# EAGLE design 20x20_adapter (EAGLE 9.4.2)
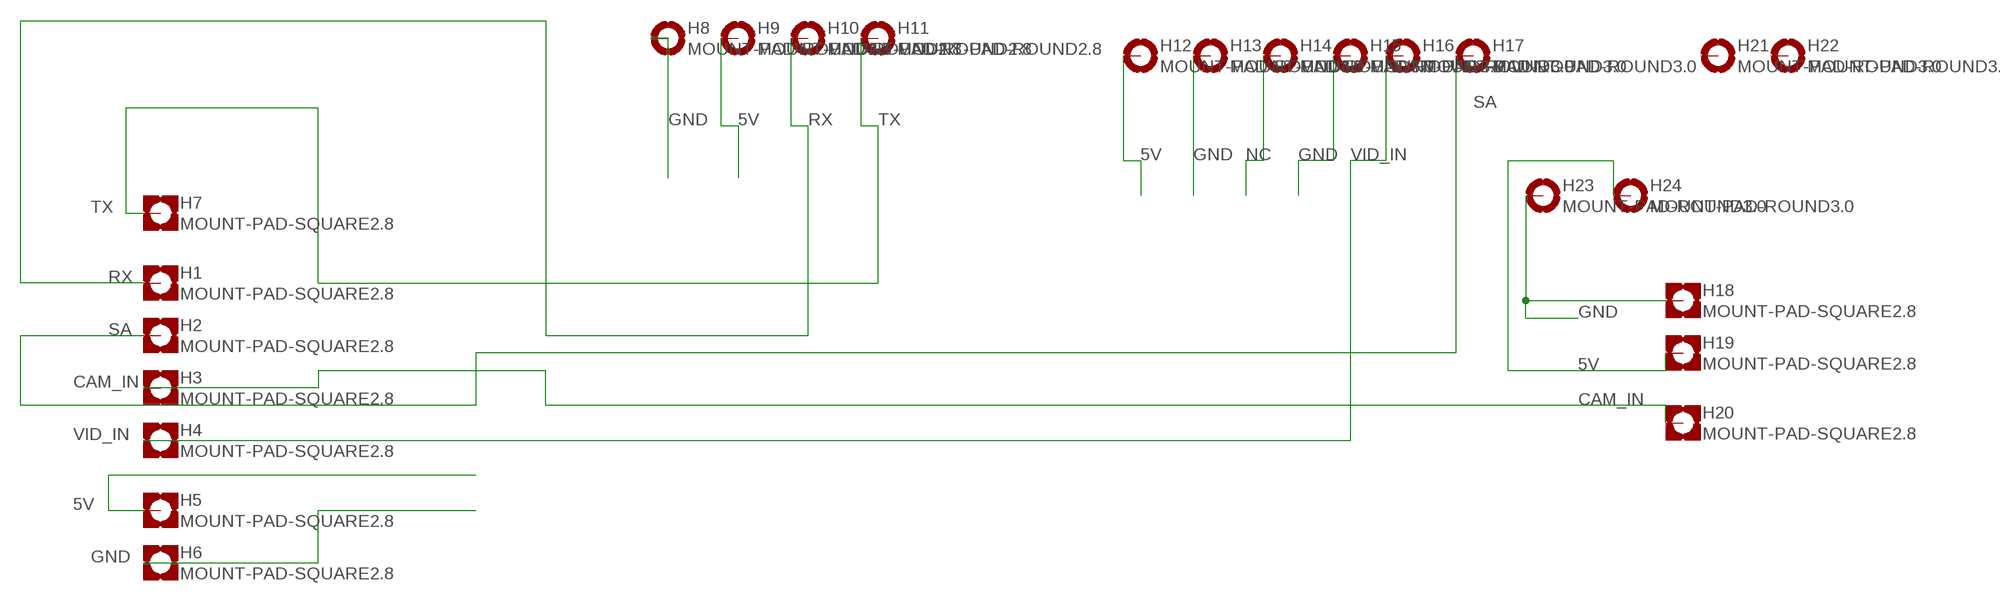
[diagram p0: schematic, sheet 1]

## Parts
H1  MOUNT-PAD-SQUARE2.8  [2,8-PAD-SQUARE]
H2  MOUNT-PAD-SQUARE2.8  [2,8-PAD-SQUARE]
H3  MOUNT-PAD-SQUARE2.8  [2,8-PAD-SQUARE]
H4  MOUNT-PAD-SQUARE2.8  [2,8-PAD-SQUARE]
H5  MOUNT-PAD-SQUARE2.8  [2,8-PAD-SQUARE]
H6  MOUNT-PAD-SQUARE2.8  [2,8-PAD-SQUARE]
H7  MOUNT-PAD-SQUARE2.8  [2,8-PAD-SQUARE]
H8  MOUNT-PAD-ROUND2.8  [1,0-PAD]
H9  MOUNT-PAD-ROUND2.8  [1,0-PAD]
H10  MOUNT-PAD-ROUND2.8  [1,0-PAD]
H11  MOUNT-PAD-ROUND2.8  [1,0-PAD]
H12  MOUNT-PAD-ROUND3.0  [3,0-PAD]
H13  MOUNT-PAD-ROUND3.0  [3,0-PAD]
H14  MOUNT-PAD-ROUND3.0  [3,0-PAD]
H15  MOUNT-PAD-ROUND3.0  [3,0-PAD]
H16  MOUNT-PAD-ROUND3.0  [3,0-PAD]
H17  MOUNT-PAD-ROUND3.0  [3,0-PAD]
H18  MOUNT-PAD-SQUARE2.8  [2,8-PAD-SQUARE]
H19  MOUNT-PAD-SQUARE2.8  [2,8-PAD-SQUARE]
H20  MOUNT-PAD-SQUARE2.8  [2,8-PAD-SQUARE]
H21  MOUNT-PAD-ROUND3.0  [3,0-PAD]
H22  MOUNT-PAD-ROUND3.0  [3,0-PAD]
H23  MOUNT-PAD-ROUND3.0  [3,0-PAD]
H24  MOUNT-PAD-ROUND3.0  [3,0-PAD]

## Nets
5V: H5.P$2(MOUNT) H9.B1,0(MOUNT) H12.B0,5(MOUNT) H19.P$2(MOUNT) H24.B0,5(MOUNT)
CAM_IN: H3.P$2(MOUNT) H20.P$2(MOUNT)
GND: H6.P$2(MOUNT) H8.B1,0(MOUNT) H13.B0,5(MOUNT) H15.B0,5(MOUNT) H18.P$2(MOUNT) H23.B0,5(MOUNT)
NC: H14.B0,5(MOUNT)
RX: H1.P$2(MOUNT) H10.B1,0(MOUNT)
SA: H2.P$2(MOUNT) H17.B0,5(MOUNT)
TX: H7.P$2(MOUNT) H11.B1,0(MOUNT)
VID_IN: H4.P$2(MOUNT) H16.B0,5(MOUNT)
Unconnected: H21.B0,5(MOUNT) H22.B0,5(MOUNT)

## Library data of the parts
H1-H7 H18-H20 = holes_custom:MOUNT-PAD-SQUARE: MOUNTING PAD, square
H8-H17 H21-H24 = holes_custom:MOUNT-PAD-ROUND: MOUNTING PAD, round

## Board
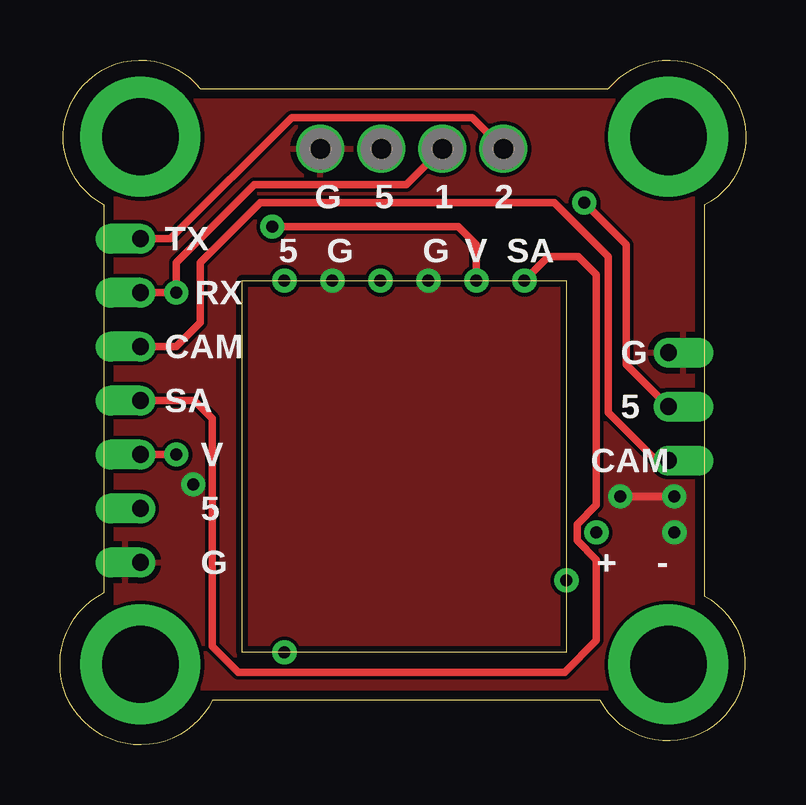
[diagram p1: board, top side]
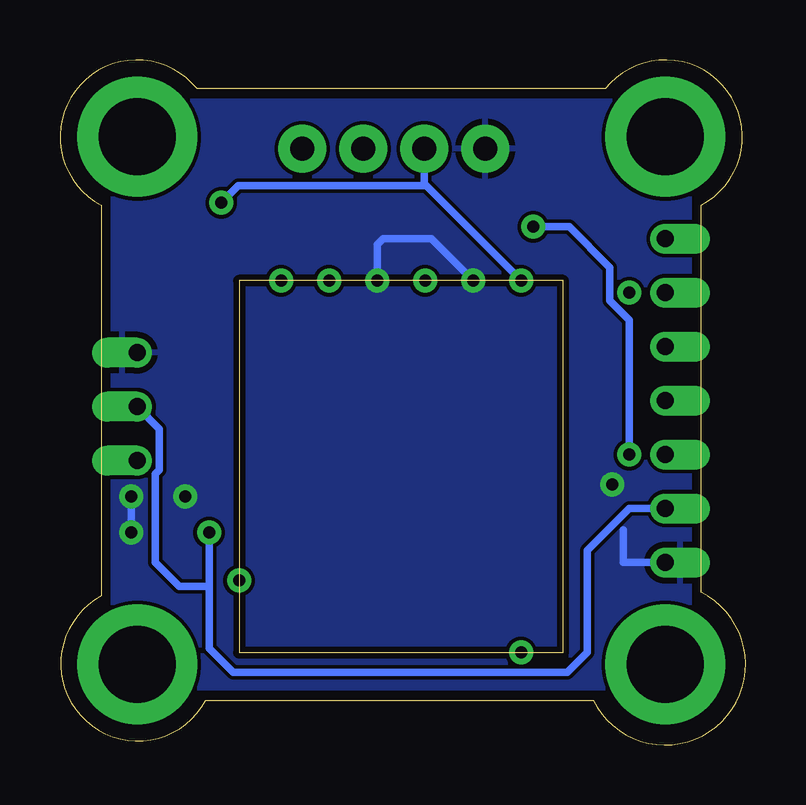
[diagram p2: board, bottom side, seen from below]

Size 28.57 x 28.56 mm. Coordinates in mm from the lower left corner, seen from the top.
Outline: 1.85,6.35 1.85,22.5 arc-204 5.85,27.35 22.85,27.35 arc-204 26.85,22.5 26.85,6.2 arc-213 22.5,1.85 6.35,1.85 arc-217 1.85,6.35
Outline: 21.1,19.35 21.1,3.85 7.6,3.85 7.6,19.35 21.1,19.35
Copper layers (1*16): Top 0.035mm / dielectric 1.5mm / Bottom 0.035mm
Design rules "SeeedStudio_2layer_DRU_no_angle_20140221": minimum track width 6mil, minimum drill 12mil, track to track 6mil, track to pad 6mil, pad to pad 6mil, via to via 6mil, smd to smd 0mil, copper to edge 10mil, drill to drill 10mil, minimum pad ring 10mil, minimum via ring 6mil, stop-mask expansion 2mil, vias tented up to drill 100mil, thermal gap 10mil

### Footprints (pad centres in the part's own frame; a part is rotated, then mirrored left to right if it is on the bottom)
2,8-PAD-SQUARE = drill 0.7 pad 1.25 offset: P$2 0.5,0
1,0-PAD = drill 1 pad 2: B1,0 0,0
3,0-PAD = drill 0.5 pad 1: B0,5 0,0

### Placement (x,y rotation side)
H1  2.85,18.85 0 top
H2  2.85,14.35 0 top
H3  2.85,16.6 0 top
H4  2.85,12.1 0 top
H5  25.85,14.1 180 top
H6  25.85,16.35 180 top
H7  2.85,21.1 0 top
H8  10.85,24.85 0 top
H9  13.39,24.85 0 top
H10  15.93,24.85 0 top
H11  18.47,24.85 0 top
H12  9.35,19.35 0 top
H13  15.35,19.35 0 top
H14  13.35,19.35 0 top
H15  11.35,19.35 180 top
H16  17.35,19.35 0 top
H17  19.35,19.35 0 top
H18  2.85,7.6 0 top
H19  2.85,9.85 0 top
H20  25.85,11.85 180 top
H21  9.35,3.85 0 top
H22  21.1,6.85 0 top
H23  25.6,8.85 0 top
H24  22.35,8.85 0 top

### Tracks (layer width: path | path; a pad name or v marks a point on that pad's centre or on a via)
5V  (via drill 0.5 pad 1)
  Top 0.305: H5.P$2 23.6,15.85 23.6,20.85 v21.85,22.6
  Bottom 0.305: H19.P$2 4.85,9.85 6.6,8.1 6.6,3.85 7.44,3.02 21.35,3.02 22.35,4.02 22.35,6.6 | 13.39,23.31 H9.B1,0 | 13.39,23.31 13.31,23.31 H12.B0,5 | v21.85,22.6 21.14,23.31 13.39,23.31 | 22.35,6.6 H24.B0,5 | H5.P$2 24.42,13.17 24.42,11.47 24.6,11.29 24.6,7.6 23.6,6.6 22.35,6.6
CAM_IN
  Top 0.305: H3.P$2 4.85,16.6 5.85,17.6 5.85,20.1 8.35,22.6 20.6,22.6 22.85,20.35 22.85,13.85 24.85,11.85 H20.P$2
GND  (via drill 0.5 pad 1)
  Top 0.305: v25.6,10.35 v23.35,10.35
  Bottom 0.305: H18.P$2 5.1,7.6 5.1,8.96 | H15.B0,5 13.1,21.1 15.1,21.1 15.35,20.85 H13.B0,5 | H23.B0,5 v25.6,10.35
  other vias: 5.55,10.85
  pour Bottom: 2.35,26.85 2.35,2.35 26.35,2.35 26.35,26.85
  pour Top: 2.35,26.85 26.35,26.85 26.35,2.35 2.35,2.35
N$1  (via drill 3.2 pad 5)
  other vias: 3.35,3.35
N$2  (via drill 3.2 pad 5)
  other vias: 3.35,25.35
N$3  (via drill 3.2 pad 5)
  other vias: 25.35,3.35
N$4  (via drill 3.2 pad 5)
  other vias: 25.35,25.35
RX  (via drill 0.5 pad 1)
  Top 0.305: H10.B1,0 14.43,23.35 8.1,23.35 4.85,20.1 v4.85,18.85 H1.P$2
SA
  Top 0.305: H17.B0,5 20.35,20.35 21.6,20.35 22.35,19.6 22.35,10 21.54,9.19 21.54,8.52 22.35,7.71 22.35,4.35 21.03,3.03 7.43,3.03 6.35,4.1 6.35,13.6 5.6,14.35 H2.P$2
TX
  Top 0.305: H11.B1,0 17.17,26.16 9.66,26.16 4.6,21.1 H7.P$2
VID_IN  (via drill 0.5 pad 1)
  Top 0.305: H16.B0,5 17.35,20.85 16.6,21.6 v8.85,21.6 | H4.P$2 v4.85,12.1
  Bottom 0.305: v4.85,12.1 4.85,17.72 5.66,18.52 5.66,19.91 7.35,21.6 v8.85,21.6

### Text on the board
tNames: G | 5 | 1 | 2 | TX | 5 | G | G | V | SA | RX | CAM | G | SA | 5 | V | CAM | 5 | G | + | -